# Altium project 200226 Precharge Controller R4 (GEN2).PrjPcb
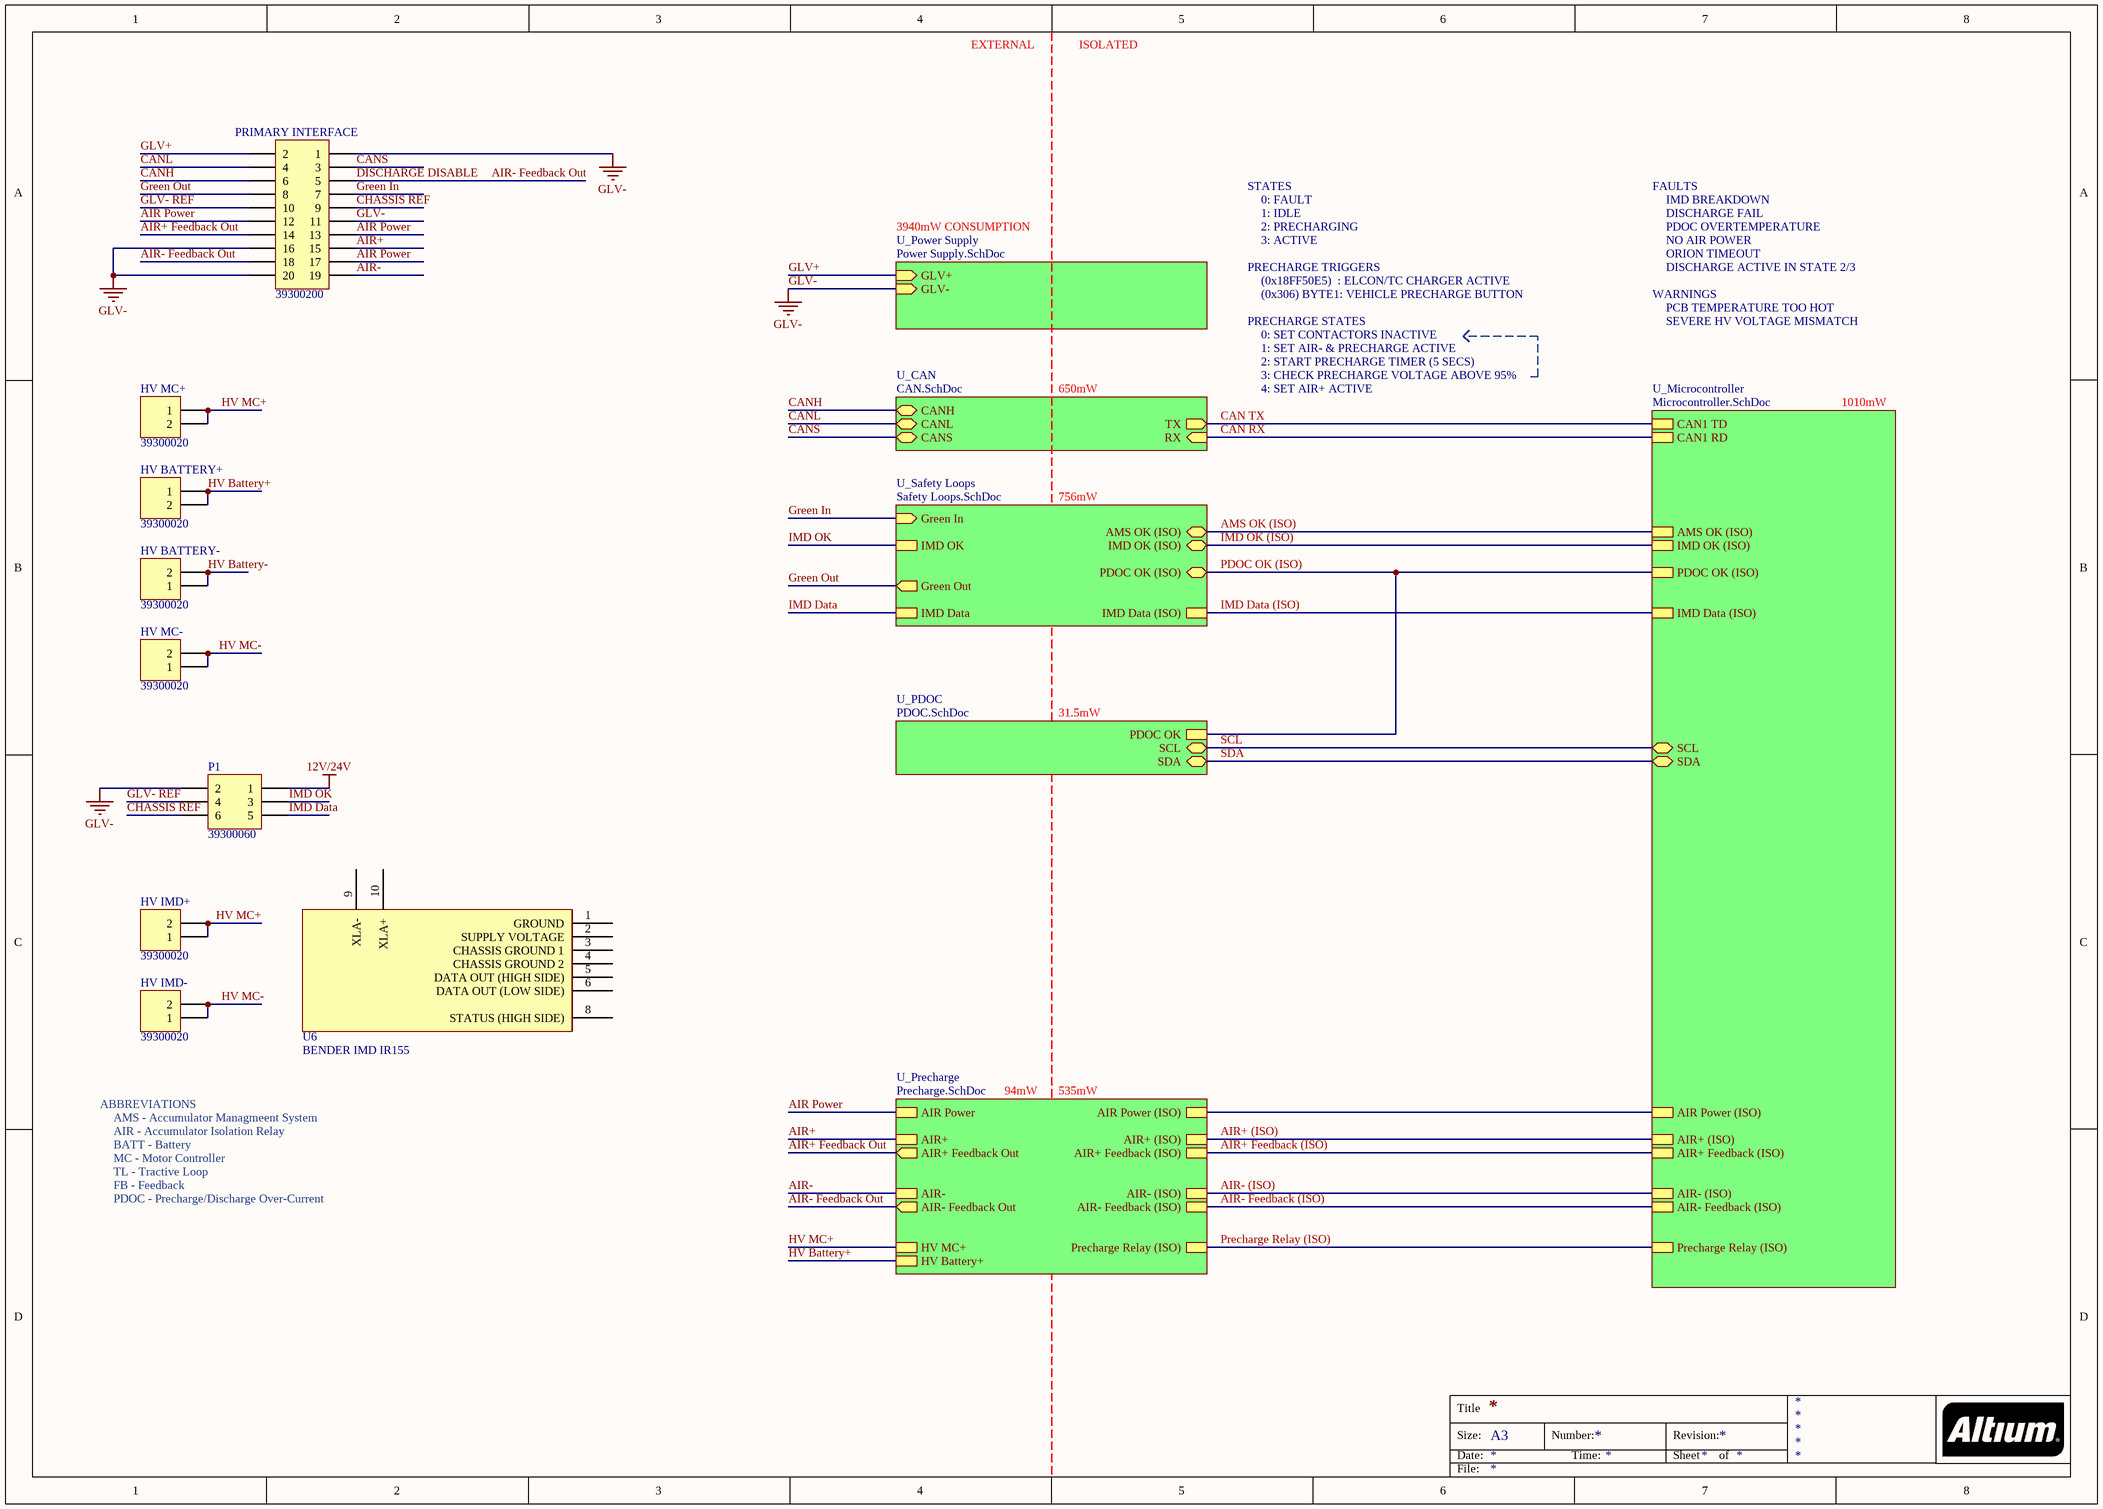
[diagram p0: Top Level.SchDoc]
4 sheets, 112 parts. Net scope: hierarchical (ports join the sheet entries above them; power ports are global).
Board file: 191228 PCB.PcbDoc
Sheets:
  Top Level.SchDoc
    U_CAN = CAN.SchDoc
    U_Precharge = Precharge.SchDoc
    U_Safety Loops = Safety Loops.SchDoc

## Sheet Top Level.SchDoc
size A3

### Parts
HV_BATTERY+  39300020  [39300020]
HV_BATTERY-  39300020  [39300020]
HV_IMD+  39300020  [39300020]
HV_IMD-  39300020  [39300020]
HV_MC+  39300020  [39300020]
HV_MC-  39300020  [39300020]
P1  39300060  [39300060]
PRIMARY_INTERFACE  39300200  [39300200]
U6  BENDER IMD IR155  [BENDER IMD IR155]

### Sub-sheets
U_CAN = CAN.SchDoc: CANH (bidir), CANL (bidir), CANS (bidir), RX (in), TX (out)
U_Microcontroller = Microcontroller.SchDoc (file not in this document): AIR- Feedback (ISO), AIR+ Feedback (ISO), AIR- (ISO), Precharge Relay (ISO), AIR+ (ISO), CAN1 TD, CAN1 RD, AIR Power (ISO), IMD OK (ISO), PDOC OK (ISO), AMS OK (ISO), IMD Data (ISO), SCL (bidir), SDA (bidir)
U_PDOC = PDOC.SchDoc (file not in this document): PDOC OK, SCL (bidir), SDA (bidir)
U_Power Supply = Power Supply.SchDoc (file not in this document): GLV+ (in), GLV- (in)
U_Precharge = Precharge.SchDoc: AIR Power, AIR- (ISO), AIR- Feedback Out (out), AIR- Feedback (ISO), AIR-, AIR+, AIR+ Feedback Out (out), AIR+ (ISO), AIR+ Feedback (ISO), Precharge Relay (ISO), HV MC+, HV Battery+, AIR Power (ISO)
U_Safety Loops = Safety Loops.SchDoc: IMD OK (ISO) (bidir), AMS OK (ISO) (bidir), PDOC OK (ISO) (bidir), Green In (in), IMD OK, Green Out (out), IMD Data, IMD Data (ISO)

### Nets
12V/24V: P1.1
AIR Power: PRIMARY_INTERFACE.12 PRIMARY_INTERFACE.13 PRIMARY_INTERFACE.17 ; sheet U_Precharge/AIR Power
GLV-: P1.2 PRIMARY_INTERFACE.1 PRIMARY_INTERFACE.11 PRIMARY_INTERFACE.16 PRIMARY_INTERFACE.20 ; sheet U_Power Supply/GLV-
AIR+: PRIMARY_INTERFACE.15 ; sheet U_Precharge/AIR+
AIR+ (ISO): sheet U_Precharge/AIR+ (ISO), sheet U_Microcontroller/AIR+ (ISO)
AIR+ Feedback (ISO): sheet U_Precharge/AIR+ Feedback (ISO), sheet U_Microcontroller/AIR+ Feedback (ISO)
AIR+ Feedback Out: PRIMARY_INTERFACE.14 ; sheet U_Precharge/AIR+ Feedback Out
AIR-: PRIMARY_INTERFACE.19 ; sheet U_Precharge/AIR-
AIR- (ISO): sheet U_Precharge/AIR- (ISO), sheet U_Microcontroller/AIR- (ISO)
AIR- Feedback (ISO): sheet U_Precharge/AIR- Feedback (ISO), sheet U_Microcontroller/AIR- Feedback (ISO)
AIR- Feedback Out: PRIMARY_INTERFACE.5 PRIMARY_INTERFACE.18 ; sheet U_Precharge/AIR- Feedback Out  [also labelled DISCHARGE DISABLE]
AMS OK (ISO): sheet U_Microcontroller/AMS OK (ISO), sheet U_Safety Loops/AMS OK (ISO)
CAN RX: sheet U_CAN/RX, sheet U_Microcontroller/CAN1 RD
CAN TX: sheet U_CAN/TX, sheet U_Microcontroller/CAN1 TD
CANH: PRIMARY_INTERFACE.6 ; sheet U_CAN/CANH
CANL: PRIMARY_INTERFACE.4 ; sheet U_CAN/CANL
CANS: PRIMARY_INTERFACE.3 ; sheet U_CAN/CANS
CHASSIS REF: P1.6 PRIMARY_INTERFACE.9
GLV+: PRIMARY_INTERFACE.2 ; sheet U_Power Supply/GLV+
GLV- REF: P1.4 PRIMARY_INTERFACE.10
Green In: PRIMARY_INTERFACE.7 ; sheet U_Safety Loops/Green In
Green Out: PRIMARY_INTERFACE.8 ; sheet U_Safety Loops/Green Out
HV Battery+: HV_BATTERY+.1 HV_BATTERY+.2 ; sheet U_Precharge/HV Battery+
HV Battery-: HV_BATTERY-.1 HV_BATTERY-.2
HV MC+: HV_IMD+.1 HV_IMD+.2 HV_MC+.1 HV_MC+.2 ; sheet U_Precharge/HV MC+
HV MC-: HV_IMD-.1 HV_IMD-.2 HV_MC-.1 HV_MC-.2
IMD Data: P1.5 ; sheet U_Safety Loops/IMD Data
IMD Data (ISO): sheet U_Microcontroller/IMD Data (ISO), sheet U_Safety Loops/IMD Data (ISO)
IMD OK: P1.3 ; sheet U_Safety Loops/IMD OK
IMD OK (ISO): sheet U_Microcontroller/IMD OK (ISO), sheet U_Safety Loops/IMD OK (ISO)
PDOC OK (ISO): sheet U_Microcontroller/PDOC OK (ISO), sheet U_Safety Loops/PDOC OK (ISO), sheet U_PDOC/PDOC OK
Precharge Relay (ISO): sheet U_Precharge/Precharge Relay (ISO), sheet U_Microcontroller/Precharge Relay (ISO)
SCL: sheet U_Microcontroller/SCL, sheet U_PDOC/SCL
SDA: sheet U_Microcontroller/SDA, sheet U_PDOC/SDA
NetAIR_POW_TP1_1: sheet U_Precharge/AIR Power (ISO), sheet U_Microcontroller/AIR Power (ISO)

Not connected (* = marked no-connect by the designer): U6 1(GROUND) 2(SUPPLY_VOLTAGE) 3(CHASSIS_GROUND_1) 4(CHASSIS_GROUND_2) 5(DATA_OUT_(HIGH_SIDE)) 6(DATA_OUT_(LOW_SIDE)) 8(STATUS_(HIGH_SIDE)) 9(XLA-) 10(XLA+)

### Notes on the sheet
- EXTERNAL
- ISOLATED
- 3940mW CONSUMPTION
- STATES
- 0: FAULT
- 1: IDLE
- 2: PRECHARGING
- 3: ACTIVE
- FAULTS
- IMD BREAKDOWN
- DISCHARGE FAIL
- PDOC OVERTEMPERATURE
- NO AIR POWER
- PRECHARGE TRIGGERS
- (0x18FF50E5)  : ELCON/TC CHARGER ACTIVE
- (0x306) BYTE1: VEHICLE PRECHARGE BUTTON
- WARNINGS
- PCB TEMPERATURE TOO HOT
- ORION TIMEOUT
- DISCHARGE ACTIVE IN STATE 2/3
- PRECHARGE STATES
- 1: SET AIR- & PRECHARGE ACTIVE
- 2: START PRECHARGE TIMER (5 SECS)
- 3: CHECK PRECHARGE VOLTAGE ABOVE 95%
- 0: SET CONTACTORS INACTIVE
- SEVERE HV VOLTAGE MISMATCH
- 650mW
- 4: SET AIR+ ACTIVE
- 1010mW
- 756mW
- 31.5mW
- ABBREVIATIONS
- AMS - Accumulator Managmeent System
- 94mW
- 535mW
- TL - Tractive Loop
- FB - Feedback
- BATT - Battery
- MC - Motor Controller
- AIR - Accumulator Isolation Relay
- PDOC - Precharge/Discharge Over-Current
- Title
- Size:
- Date:
- A3
- Number:
- Time:
- Revision:
- Sheet
- of
- File:

### Library data of the parts
HV_BATTERY+ HV_BATTERY- HV_IMD+ HV_IMD- HV_MC+ HV_MC- = 39300020: Positions: 2; Pitch: 4.2mm; Row Spacing: 5.5mm; Angle: 90; Flange: No; Contact: Tin; Part Number: 39300020; Digikey Part Number: WM21351-ND
P1 = 39300060: Positions: 6; Pitch: 4.2mm; Row Spacing: 5.5mm; Angle: 90; Flange: No; Contact: Tin; Part Number: 39300060; Digikey Part Number: WM21353-ND
PRIMARY_INTERFACE = 39300200: Positions: 20; Pitch: 4.2mm; Row Spacing: 5.5mm; Angle: 90; Flange: No; Contact: Tin; Part Number: 39300200; Digikey Part Number: WM21360-ND
U6 = BENDER IMD IR155: Insulation monitoring device (IMD) for unearthed DC drive systems (IT systems) in electric vehicles.; Part Number: BENDER IMD IR155; Manufacturer: Bender; Link: https://www.bender.de/en/products/insulation-monitoring/isometer_ir155-3203ir155-3204

## Sheet CAN.SchDoc
size A4
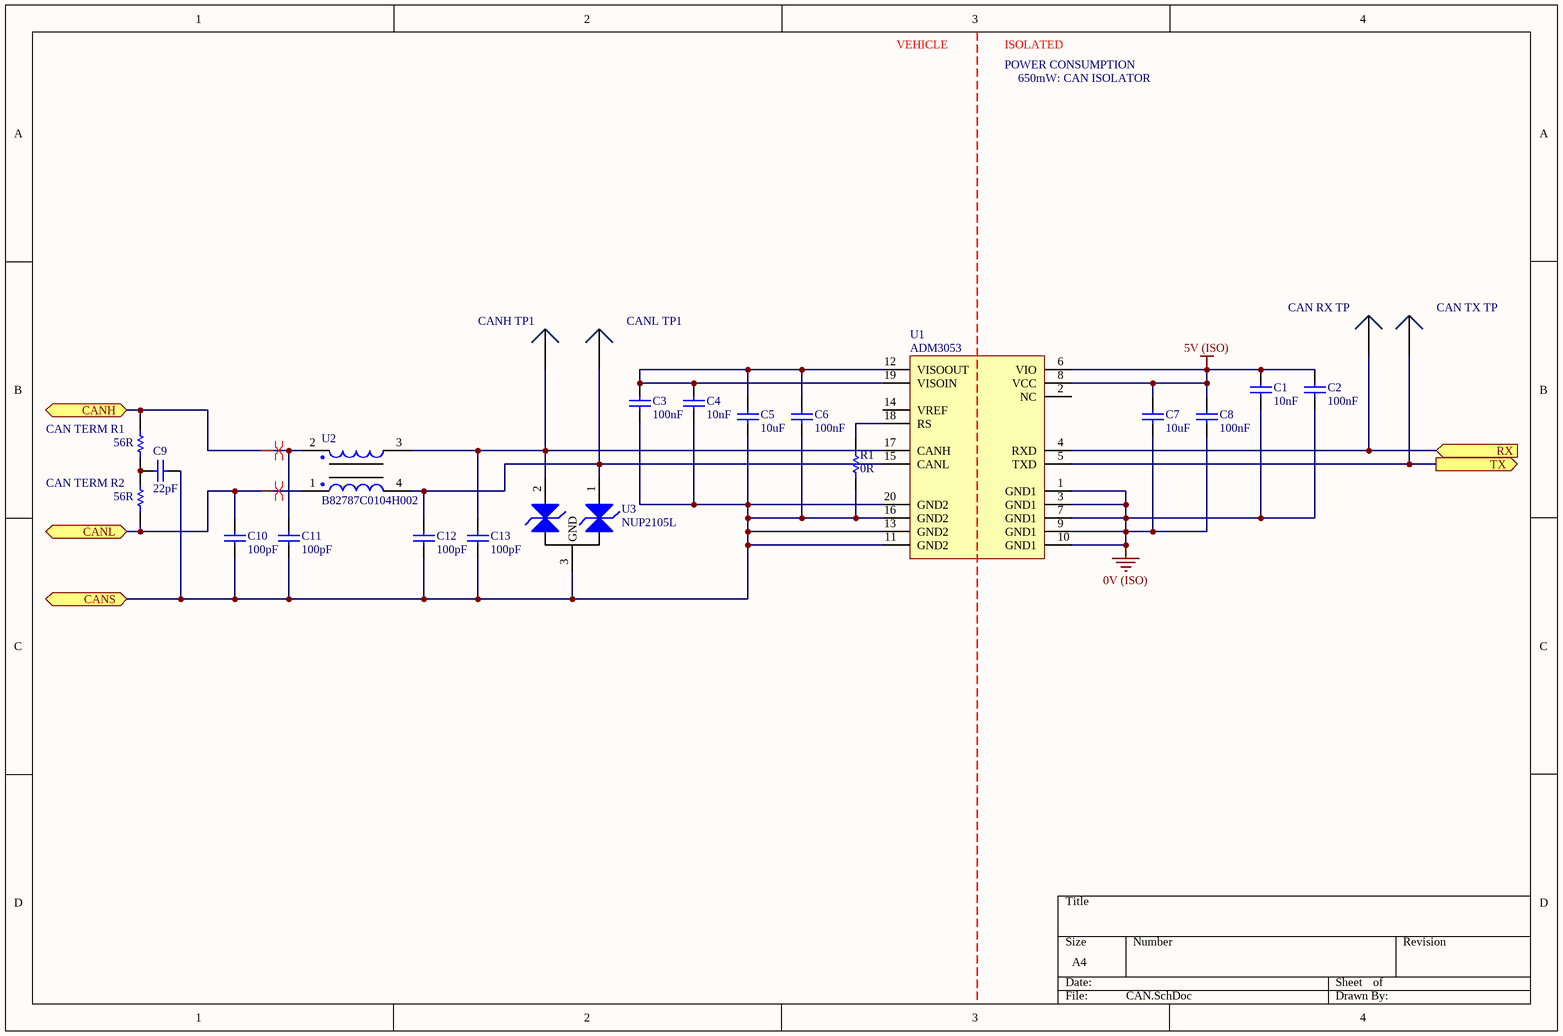
[diagram p1: CAN.SchDoc]

### Parts
C1  10nF  [1206]
C2  100nF  [0805]
C3  100nF  [0805]
C4  10nF  [1206]
C5  10uF  [0805]
C6  100nF  [0805]
C7  10uF  [0805]
C8  100nF  [0805]
C9  22pF  [0805]
C10  100pF  [0805]
C11  100pF  [0805]
C12  100pF  [0805]
C13  100pF  [0805]
CAN_RX_TP  0mm  [SMD Test Point]  (value not drawn)
CAN_TERM_R1  56R  [0805]
CAN_TERM_R2  56R  [0805]
CAN_TX_TP  0mm  [SMD Test Point]  (value not drawn)
CANH_TP1  0mm  [SMD Test Point]  (value not drawn)
CANL_TP1  0mm  [SMD Test Point]  (value not drawn)
R1  0R  [0805]
U1  ADM3053  [AD SOIC-W 20]
U2  B82787C0104H002  [TDK 4-PC Pad]
U3  NUP2105L  [ON SOT-23 BJT]

### Ports
CANH (bidir), CANL (bidir), CANS (bidir), RX (in), TX (out)

### Nets
0V (ISO): C1.1 C2.1 C7.1 C8.1 U1.1(GND1) U1.3(GND1) U1.7(GND1) U1.9(GND1) U1.10(GND1)
5V (ISO): C1.2 C2.2 C7.2 C8.2 U1.6(VIO) U1.8(VCC)
CAN RX: CAN_RX_TP.1 U1.4(RXD) ; port RX
CAN TX: CAN_TX_TP.1 U1.5(TXD) ; port TX
CANH: C11.2 CAN_TERM_R1.2 U2.2 ; port CANH
CANL: C10.2 CAN_TERM_R2.1 U2.1 ; port CANL
CANS: C3.1 C4.1 C5.1 C6.1 C9.1 C10.1 C11.1 C12.1 C13.1 R1.1 U1.11(GND2) U1.13(GND2) U1.16(GND2) U1.20(GND2) U3.3(GND) ; port CANS
NetC3_2: C3.2 C4.2 C5.2 C6.2 U1.12(VISOOUT) U1.19(VISOIN)
NetC9_2: C9.2 CAN_TERM_R1.1 CAN_TERM_R2.2
NetC12_2: C12.2 CANL_TP1.1 U1.15(CANL) U2.4 U3.1(CAN_H)
NetC13_2: C13.2 CANH_TP1.1 U1.17(CANH) U2.3 U3.2(CAN_L)
NetR1_2: R1.2 U1.18(RS)

Not connected (* = marked no-connect by the designer): U1 2(NC) 14(VREF)

### Layout directives
differential pair; differential pair class CANBUS OUT: CANH, CANL

### Notes on the sheet
- VEHICLE
- ISOLATED
- POWER CONSUMPTION
- 650mW: CAN ISOLATOR

### Library data of the parts
C1 C4 = GCM3195C2A103JA16D: Manufacturer: muRata; Tolerance: 5%; Material: Ceramic; Rated Voltage: 100V; Part Number: GCM3195C2A103JA16D; Value: 10nF; Digikey Part Number: 490-4978-2-ND
C2 C3 C6 C8 = GCM21BR71H104KA37L: Manufacturer: muRata; Tolerance: ±10%; Material: X7R; Rated Voltage: 50V; Part Number: GCM21BR71H104KA37L; Value: 100nF; Digikey Part Number: 490-6064-1-ND
C5 C7 = GRM21BR6YA106KE43L: Manufacturer: muRata; Tolerance: 10%; Material: X5R; Rated Voltage: 50V; Part Number: GRM21BR6YA106KE43L; Value: 10uF; Digikey Part Number: 490-10514-6-ND
C9 = GRM21A5C2E220JW01D: Manufacturer: muRata; Tolerance: ±5%; Material: C0G, NP0; Rated Voltage: 250V; Part Number: GRM21A5C2E220JW01D; Value: 22pF; Digikey Part Number: 490-5534-1-ND
C10-C13 = GCM2165C1H101JA16D: Manufacturer: muRata; Tolerance: ±5%; Material: C0G, NP0; Rated Voltage: 50V; Part Number: GCM2165C1H101JA16D; Value: 100pF; Digikey Part Number: 490-8031-1-ND
CAN_RX_TP CAN_TX_TP CANH_TP1 CANL_TP1 = SMD Test Point: Positions: 1; Row Spacing: 0; Flange: No; Contact: NA; Part Number: SMD Test Point; Pitch: 0mm; Angle: 0
CAN_TERM_R1 CAN_TERM_R2 = RC0805FR0756RL: Manufacturer: YAGEO; Tolerance: 0.01; Rated Voltage: 0.125W; Part Number: RC0805FR0756RL; Value: 56R; Material: FR-07; Digikey Part Number: 311-56.0CRCT-ND
R1 = RC0805FR070RL: Manufacturer: YAGEO; Tolerance: 0.01; Rated Voltage: 0.125W; Part Number: RC0805FR070RL; Value: 0R; Material: FR-07; Digikey Part Number: 311-0.0CRCT-ND
U1 = ADM3053: Isolated CAN Transceiver; Manufacturer: Analogue Devices; Part Number: ADM3053; Digikey Part Number: ADM3053BRWZ-ND; Digikey Link: https://www.digikey.com/product-detail/en/analog-devices-inc/ADM3053BRWZ/ADM3053BRWZ-ND/2709332
U2 = B82787C0104H002: 100µH @ 100kHz 2 Line Common Mode Choke Surface Mount 5.8 kOhms @ 10MHz 150mA DCR 2Ohm; Manufacturer: EPCOS (TDK); Part Number: B82787C0104H002; Inductance: 100µH @ 100kHz; Impedence: 5.8 kOhms @ 10MHz; Material: Wirewound; Rated Current: 150mA; Digikey Part Number: 495-4598-1-ND; Digikey Link: https://www.digikey.com/product-detail/en/epcos-tdk/B82787C0104H002/495-4598-2-ND/3680998
U3 = NUP2105L: Dual Line CAN Bus Protector; Manufacturer: ON Semiconductor; Part Number: NUP2105L; Digikey Part Number: NUP2105LT1GOSCT-ND; Digikey Link: https://www.digikey.com/product-detail/en/on-semiconductor/NUP2105LT1G/NUP2105LT1GOSCT-ND/1485001

## Sheet Precharge.SchDoc
size A3
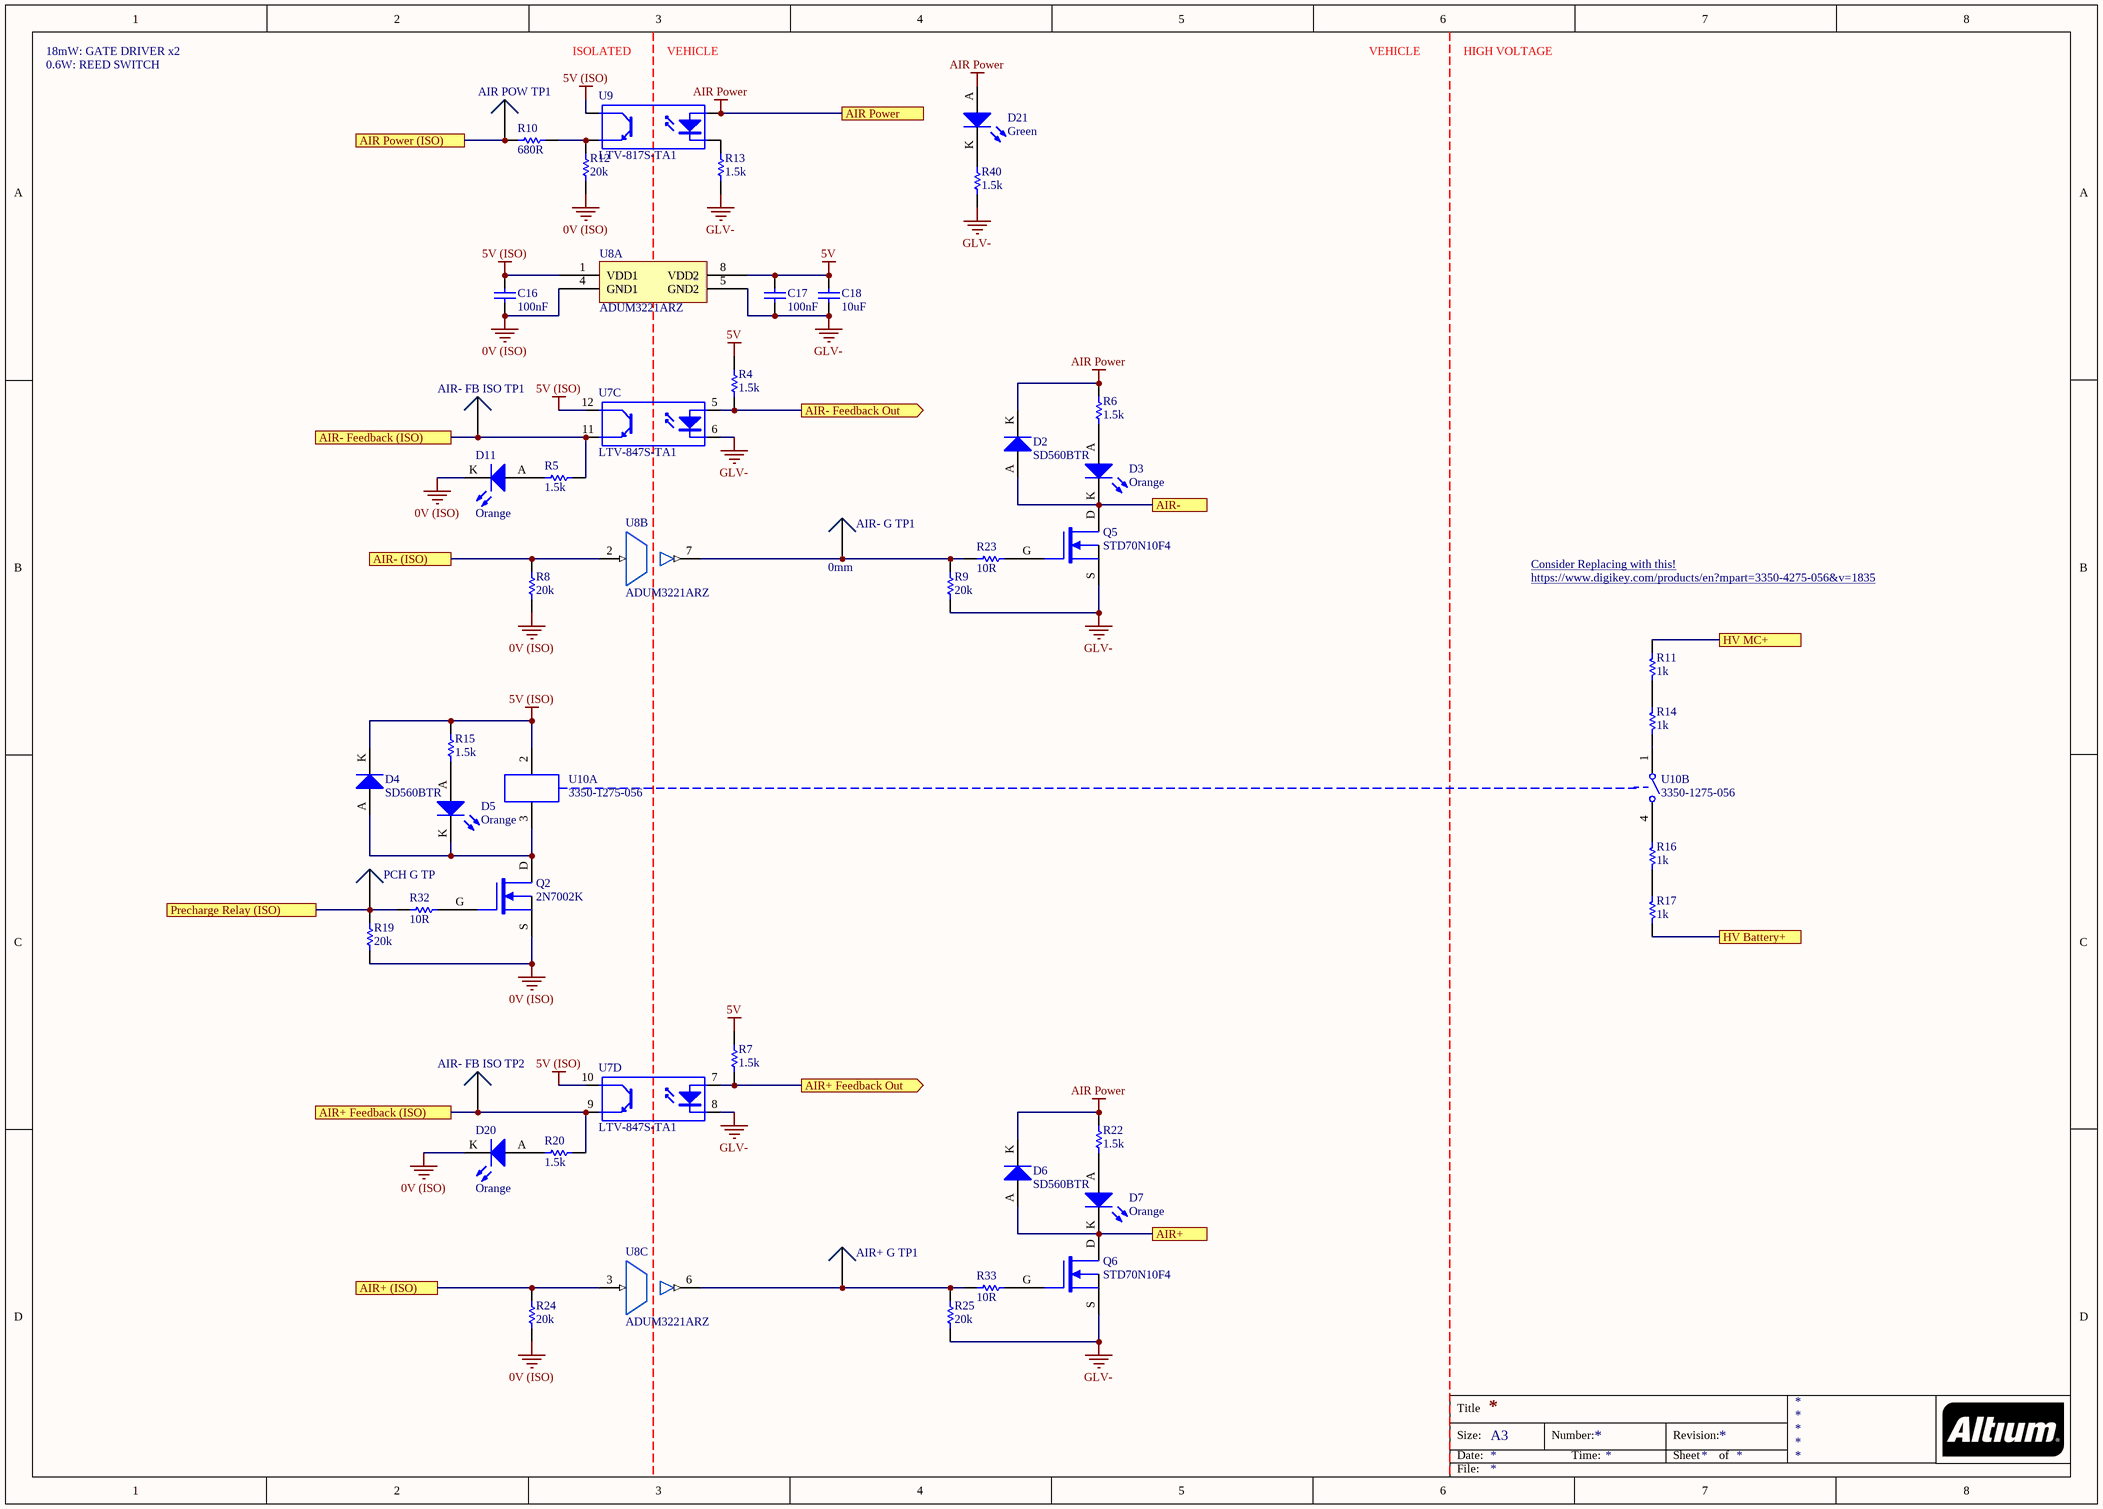
[diagram p2: Precharge.SchDoc]

### Parts
AIR+_G_TP1  0mm  [SMD Test Point]  (value not drawn)
AIR-_FB_ISO_TP1  0mm  [SMD Test Point]  (value not drawn)
AIR-_FB_ISO_TP2  0mm  [SMD Test Point]  (value not drawn)
AIR-_G_TP1  0mm  [SMD Test Point]
AIR_POW_TP1  0mm  [SMD Test Point]  (value not drawn)
C16  100nF  [0805]
C17  100nF  [0805]
C18  10uF  [0805]
D2  SD560BTR  [SMB Diode]
D3  Orange  [0805 LED]
D4  SD560BTR  [SMB Diode]
D5  Orange  [0805 LED]
D6  SD560BTR  [SMB Diode]
D7  Orange  [0805 LED]
D11  Orange  [0805 LED]
D20  Orange  [0805 LED]
D21  Green  [0805 LED]
PCH_G_TP  0mm  [SMD Test Point]  (value not drawn)
Q2  2N7002K  [SOT-343_N]
Q5  STD70N10F4  [SOT-343_N]
Q6  STD70N10F4  [SOT-343_N]
R4  1.5k  [0805]
R5  1.5k  [0805]
R6  1.5k  [0805]
R7  1.5k  [0805]
R8  20k  [0805]
R9  20k  [0805]
R10  680R  [0805]
R11  1k  [B TO-263]
R12  20k  [0805]
R13  1.5k  [0805]
R14  1k  [B TO-263]
R15  1.5k  [0805]
R16  1k  [B TO-263]
R17  1k  [B TO-263]
R19  20k  [0805]
R20  1.5k  [0805]
R22  1.5k  [0805]
R23  10R  [0805]
R24  20k  [0805]
R25  20k  [0805]
R32  10R  [0805]
R33  10R  [0805]
R40  1.5k  [0805]
U7  LTV-847S-TA1  [ON 16-SMD]  (parts C,D of 4)
U8  ADUM3221ARZ  [AD 8-SOIC]  (parts A,B,C of 3)
U9  LTV-817S-TA1  [ON 4-SMD]
U10  3350-1275-056  [CI SPST]  (parts A,B of 2)

### Ports
AIR Power, AIR Power (ISO), AIR+, AIR+ (ISO), AIR+ Feedback (ISO), AIR+ Feedback Out (out), AIR-, AIR- (ISO), AIR- Feedback (ISO), AIR- Feedback Out (out), HV Battery+, HV MC+, Precharge Relay (ISO)

### Nets
0V (ISO): C16.1 D11.K D20.K Q2.S R8.1 R12.1 R19.1 R24.1 U8.4(GND1)
5V: C17.2 C18.2 R4.2 R7.2 U8.8(VDD2)
5V (ISO): C16.2 D4.K R15.2 U7.10(C) U7.12(C) U8.1(VDD1) U9.4(C) U10.2
AIR Power: D2.K D6.K D21.A R6.2 R22.2 U9.1(A) ; port AIR Power
GLV-: C17.1 C18.1 Q5.S Q6.S R9.1 R13.2 R25.1 R40.2 U7.6(K) U7.8(K) U8.5(GND2)
AIR+: D6.A D7.K Q6.D ; port AIR+
AIR+ (ISO): R24.2 U8.3(VIA) ; port AIR+ (ISO)
AIR+ Feedback (ISO): AIR-_FB_ISO_TP2.1 R20.2 U7.9(E) ; port AIR+ Feedback (ISO)
AIR+ Feedback Out: R7.1 U7.7(A) ; port AIR+ Feedback Out
AIR-: D2.A D3.K Q5.D ; port AIR-
AIR- (ISO): R8.2 U8.2(VIA) ; port AIR- (ISO)
AIR- Feedback (ISO): AIR-_FB_ISO_TP1.1 R5.2 U7.11(E) ; port AIR- Feedback (ISO)
AIR- Feedback Out: R4.1 U7.5(A) ; port AIR- Feedback Out
HV Battery+: R17.1 ; port HV Battery+
HV MC+: R11.2 ; port HV MC+
Precharge Relay (ISO): PCH_G_TP.1 R19.2 R32.1 ; port Precharge Relay (ISO)
NetAIR+_G_TP1_1: AIR+_G_TP1.1 R25.2 R33.1 U8.6(VOA)
NetAIR-_G_TP1_1: AIR-_G_TP1.1 R9.2 R23.1 U8.7(VOA)
NetAIR_POW_TP1_1: AIR_POW_TP1.1 R10.1 ; port AIR Power (ISO)
NetD3_A: D3.A R6.1
NetD4_A: D4.A D5.K Q2.D U10.3
NetD5_A: D5.A R15.1
NetD7_A: D7.A R22.1
NetD11_A: D11.A R5.1
NetD20_A: D20.A R20.1
NetD21_K: D21.K R40.1
NetQ2_G: Q2.G R32.2
NetQ5_G: Q5.G R23.2
NetQ6_G: Q6.G R33.2
NetR10_2: R10.2 R12.2 U9.3(E)
NetR11_1: R11.1 R14.2
NetR13_1: R13.1 U9.2(K)
NetR14_1: R14.1 U10.1
NetR16_1: R16.1 R17.2
NetR16_2: R16.2 U10.4

### Notes on the sheet
- 18mW: GATE DRIVER x2
- 0.6W: REED SWITCH
- ISOLATED
- VEHICLE
- HIGH VOLTAGE
- https://www.digikey.com/products/en?mpart=3350-4275-056&v=1835
- Consider Replacing with this! <https://www.digikey.com/products/en?mpart=3350-4275-056&v=1835>
- Title
- Size:
- Date:
- A3
- Number:
- Time:
- Revision:
- Sheet
- of
- File:

### Library data of the parts
AIR+_G_TP1 AIR-_FB_ISO_TP1 AIR-_FB_ISO_TP2 AIR-_G_TP1 AIR_POW_TP1 PCH_G_TP = SMD Test Point: as CAN_RX_TP on sheet CAN; Part Number: SMD Test Point; Pitch: 0mm; Angle: 0
C16 C17 = GCM21BR71H104KA37L: as C2 on sheet CAN; Part Number: GCM21BR71H104KA37L; Value: 100nF; Digikey Part Number: 490-6064-1-ND
C18 = GRM21BR6YA106KE43L: as C5 on sheet CAN; Part Number: GRM21BR6YA106KE43L; Value: 10uF; Digikey Part Number: 490-10514-6-ND
D2 D4 D6 = SD560BTR: 1.2V_F 600V 5A SMB; Manufacturer: SMC Diode Solutions; Part Number: SD560BTR; Digikey Part Number: 1655-1530-2-ND; Digikey Link: https://www.digikey.com/product-detail/en/smc-diode-solutions/SD560BTR/1655-1530-2-ND/6022620
D3 D5 D7 D11 D20 = SML-211DTT86: Orange LED Indication - Discrete 1.75V 0805 (2012 Metric); Manufacturer: ROHM Semiconductor; Part Number: SML-211DTT86; Colour: Orange; Digikey Part Number: 511-1291-1-ND; Digikey Link: https://www.digikey.com/product-detail/en/rohm-semiconductor/SML-211DTT86/511-1291-1-ND/637104
D21 = SML-210FTT86: Green LED Indication - Discrete 1.75V 0805 (2012 Metric); Manufacturer: ROHM Semiconductor; Part Number: SML-210FTT86; Colour: Green; Digikey Part Number: 511-1285-1-ND; Digikey Link: https://www.digikey.com/product-detail/en/rohm-semiconductor/SML-210FTT86/511-1285-1-ND/637098
Q2 = 2N7002K: 60V 380mA, NFET MOSTFET (Small Signal); Manufacturer: ON Semiconductor; Published: 24-Mar-1999; LatestRevisionDate: 29-May-2009; LatestRevisionNote: IPC-7351 Footprint Added.; PackageVersion: Sep-2000; PackageReference: SOT-343; Publisher: Altium Limited; PackageDescription: 4-Pin SOT-343 Package 1.3 mm Pitch, 2.1 mm Lead Span; Part Number: 2N7002K; Digikey Part Number: 2N7002KCT-ND; Digikey Link: https://www.digikey.com/product-detail/en/on-semiconductor/2N7002K/2N7002KCT-ND/2060375; Qty: 30
Q5 Q6 = STD70N10F4: N-Channel 100V 60A (Tc) 125W (Tc) Surface Mount DPAK; Manufacturer: STMicroelectronics; Published: 24-Mar-1999; LatestRevisionDate: 29-May-2009; LatestRevisionNote: IPC-7351 Footprint Added.; PackageVersion: Sep-2000; PackageReference: SOT-343; Publisher: Altium Limited; PackageDescription: 4-Pin SOT-343 Package 1.3 mm Pitch, 2.1 mm Lead Span; Part Number: STD70N10F4; Digikey Part Number: 497-8806-2-ND; Digikey Link: https://www.digikey.com/product-detail/en/stmicroelectronics/STD70N10F4/497-8806-2-ND/2035599
R4-R7 R13 R15 R20 R22 R40 = RC0805FR071K5L: Manufacturer: YAGEO; Tolerance: 0.01; Rated Voltage: 0.125W; Part Number: RC0805FR071K5L; Value: 1.5k; Material: FR-07; Digikey Part Number: 311-1.50KCRCT-ND
R8 R9 R12 R19 R24 R25 = RC0805FR0720KL: Manufacturer: YAGEO; Tolerance: 0.01; Rated Voltage: 0.125W; Part Number: RC0805FR0720KL; Value: 20k; Material: FR-07; Digikey Part Number: 311-20.0KCRCT-ND
R10 = RC0805FR07680RL: Manufacturer: YAGEO; Tolerance: 0.01; Rated Voltage: 0.125W; Part Number: RC0805FR07680RL; Value: 680R; Material: FR-07; Digikey Part Number: 311-680CRCT-ND
R11 R14 R16 R17 = PWR263S-35-1001J: Manufacturer: Bournes Inc; Tolerance: 0.05; Rated Voltage: 35W; Part Number: PWR263S-35-1001J; Value: 1k; Digikey Part Number: PWR263S-35-1001J-ND
R23 R32 R33 = RC0805FR0710RL: Manufacturer: YAGEO; Tolerance: 0.01; Rated Voltage: 0.125W; Part Number: RC0805FR0710RL; Value: 10R; Material: FR-07; Digikey Part Number: 311-10.0CRCT-ND
U7 = LTV-847S-TA1: Optoisolator Transistor Output 5000Vrms 4 Channel 16-SMD; Manufacturer: Lite-On Inc; Part Number: LTV-847S-TA1; Digikey Part Number: 160-1371-5-ND; Digikey Link: https://www.digikey.com.au/product-detail/en/lite-on-inc/LTV-847S/160-1371-5-ND/385841
U8 = ADUM3221ARZ: 4A Gate Driver Magnetic Coupling 2500Vrms 2 Channel 8-SOIC; Manufacturer: Analog Devices; Part Number: ADUM3221ARZ; Digikey Part Number: ADUM3221ARZ-ND; Digikey Link: https://www.digikey.com/product-detail/en/analog-devices-inc/ADUM3221ARZ/ADUM3221ARZ-ND/2616333
U9 = LTV-817S-TA1: 35V 50ma Optocoupler (VF=1.2V); Manufacturer: Lite-On Inc; Part Number: LTV-817S-TA1; Digikey Part Number: 160-1893-2-ND; Digikey Link: https://www.digikey.com/product-detail/en/lite-on-inc/LTV-817S-TA1/160-1893-2-ND/388451
U10 = 3350-1275-056: RELAY REED HV SPST 200W 3A 5V (NO); Manufacturer: Comus International; Part Number: 3350-1275-056; Digikey Part Number: 1835-1036-ND; Digikey Link: https://www.digikey.com.au/product-detail/en/comus-international/3350-1275-056/1835-1036-ND/7515918

## Sheet Safety Loops.SchDoc
size A3
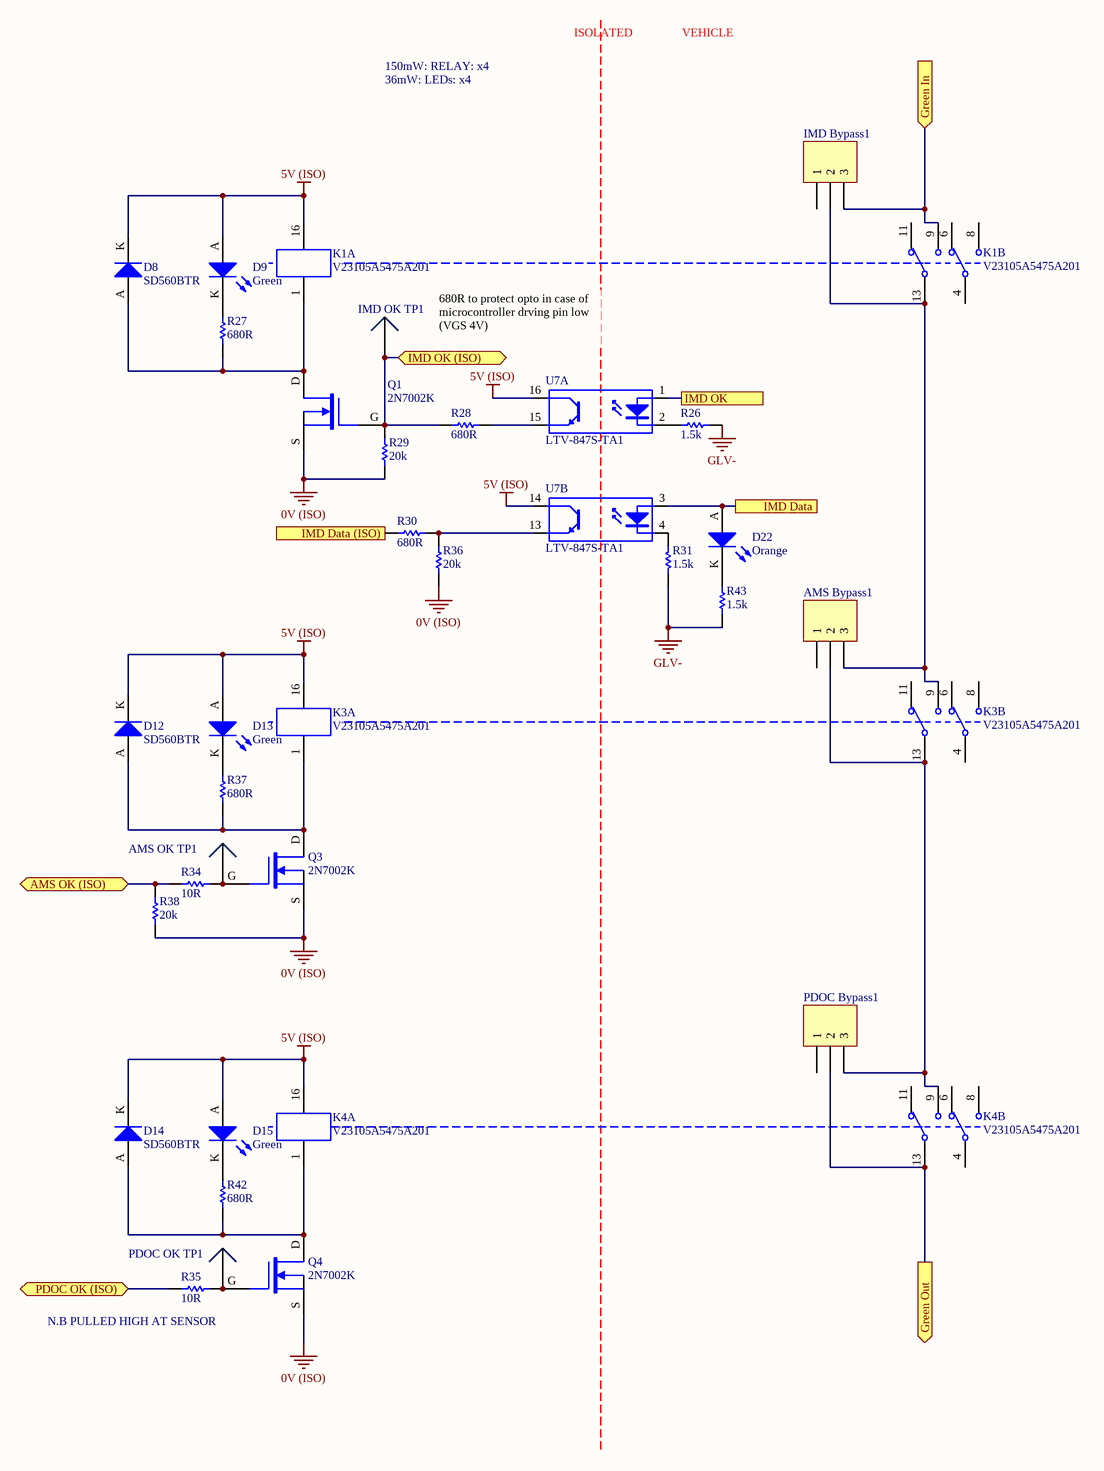
[diagram p3: Safety Loops.SchDoc]

### Parts
AMS_Bypass1  2.54mm  [TH 2.54mm Header 1x3]  (value not drawn)
AMS_OK_TP1  0mm  [SMD Test Point]  (value not drawn)
D8  SD560BTR  [SMB Diode]
D9  Green  [0805 LED]
D12  SD560BTR  [SMB Diode]
D13  Green  [0805 LED]
D14  SD560BTR  [SMB Diode]
D15  Green  [0805 LED]
D22  Orange  [0805 LED]
IMD_Bypass1  2.54mm  [TH 2.54mm Header 1x3]  (value not drawn)
IMD_OK_TP1  0mm  [SMD Test Point]  (value not drawn)
K1  V23105A5475A201  [TI 2-DIL]  (parts A,B of 2)
K3  V23105A5475A201  [TI 2-DIL]  (parts A,B of 2)
K4  V23105A5475A201  [TI 2-DIL]  (parts A,B of 2)
PDOC_Bypass1  2.54mm  [TH 2.54mm Header 1x3]  (value not drawn)
PDOC_OK_TP1  0mm  [SMD Test Point]  (value not drawn)
Q1  2N7002K  [SOT-343_N]
Q3  2N7002K  [SOT-343_N]
Q4  2N7002K  [SOT-343_N]
R26  1.5k  [0805]
R27  680R  [0805]
R28  680R  [0805]
R29  20k  [0805]
R30  680R  [0805]
R31  1.5k  [0805]
R34  10R  [0805]
R35  10R  [0805]
R36  20k  [0805]
R37  680R  [0805]
R38  20k  [0805]
R42  680R  [0805]
R43  1.5k  [0805]
U7  LTV-847S-TA1  [ON 16-SMD]  (parts A,B of 4)

### Ports
AMS OK (ISO) (bidir), Green In (in), Green Out (out), IMD Data, IMD Data (ISO), IMD OK, IMD OK (ISO) (bidir), PDOC OK (ISO) (bidir)

### Nets
0V (ISO): Q1.S Q3.S Q4.S R29.1 R36.1 R38.1
5V (ISO): D8.K D9.A D12.K D13.A D14.K D15.A K1.16 K3.16 K4.16 U7.14(C) U7.16(C)
GLV-: R26.1 R31.2 R43.2
AMS OK (ISO): R34.1 R38.2 ; port AMS OK (ISO)
Green In: IMD_Bypass1.3 K1.9 ; port Green In
Green Out: K4.13 PDOC_Bypass1.2 ; port Green Out
IMD Data: D22.A U7.3(A) ; port IMD Data
IMD Data (ISO): R30.1 ; port IMD Data (ISO)
IMD OK: U7.1(A) ; port IMD OK
IMD OK (ISO): IMD_OK_TP1.1 Q1.G R28.1 R29.2 ; port IMD OK (ISO)
PDOC OK (ISO): R35.1 ; port PDOC OK (ISO)
NetAMS_Bypass1_2: AMS_Bypass1.2 K3.13 K4.9 PDOC_Bypass1.3
NetAMS_Bypass1_3: AMS_Bypass1.3 IMD_Bypass1.2 K1.13 K3.9
NetAMS_OK_TP1_1: AMS_OK_TP1.1 Q3.G R34.2
NetD8_A: D8.A K1.1 Q1.D R27.1
NetD9_K: D9.K R27.2
NetD12_A: D12.A K3.1 Q3.D R37.1
NetD13_K: D13.K R37.2
NetD14_A: D14.A K4.1 Q4.D R42.1
NetD15_K: D15.K R42.2
NetD22_K: D22.K R43.1
NetPDOC_OK_TP1_1: PDOC_OK_TP1.1 Q4.G R35.2
NetR26_2: R26.2 U7.2(K)
NetR28_2: R28.2 U7.15(E)
NetR30_2: R30.2 R36.2 U7.13(E)
NetR31_1: R31.1 U7.4(K)

Not connected (* = marked no-connect by the designer): AMS_Bypass1 1; IMD_Bypass1 1; K1 4 6 8 11; K3 4 6 8 11; K4 4 6 8 11; PDOC_Bypass1 1

### Notes on the sheet
- 150mW: RELAY: x4
- 36mW: LEDs: x4
- ISOLATED
- VEHICLE
- 680R to protect opto in case of microcontroller drving pin low (VGS 4V)
- (near R35) N.B PULLED HIGH AT SENSOR
- Title
- Size:
- Date:
- A3
- Number:
- Time:
- Revision:
- Sheet
- of
- File:

### Library data of the parts
AMS_Bypass1 IMD_Bypass1 PDOC_Bypass1 = TH 2.54mm Header 1x3: Positions: 3; Angle: 0; Flange: No; Contact: NA; Part Number: TH 2.54mm Header 1x3; Pitch: 2.54mm; Row Spacing: 2.54mm
AMS_OK_TP1 IMD_OK_TP1 PDOC_OK_TP1 = SMD Test Point: as CAN_RX_TP on sheet CAN; Part Number: SMD Test Point; Pitch: 0mm; Angle: 0
D8 D12 D14 = SD560BTR: as D2 on sheet Precharge; Part Number: SD560BTR; Digikey Part Number: 1655-1530-2-ND; Digikey Link: https://www.digikey.com/product-detail/en/smc-diode-solutions/SD560BTR/1655-1530-2-ND/6022620
D9 D13 D15 = SML-210FTT86: as D21 on sheet Precharge; Part Number: SML-210FTT86; Colour: Green; Digikey Part Number: 511-1285-1-ND; Digikey Link: https://www.digikey.com/product-detail/en/rohm-semiconductor/SML-210FTT86/511-1285-1-ND/637098
D22 = SML-211DTT86: as D3 on sheet Precharge; Part Number: SML-211DTT86; Colour: Orange; Digikey Part Number: 511-1291-1-ND; Digikey Link: https://www.digikey.com/product-detail/en/rohm-semiconductor/SML-211DTT86/511-1291-1-ND/637104
K1 K3 K4 = V23105A5475A201: 5V DPDT Relay 3A 220VDC; Manufacturer: Axicom; Part Number: V23105A5475A201; Digikey Part Number: PB383-ND; Digikey Link: https://www.digikey.com/products/en?mpart=V23105A5001A201&v=41
Q1 Q3 Q4 = 2N7002K: as Q2 on sheet Precharge; Published: 24-Mar-1999; LatestRevisionDate: 29-May-2009; LatestRevisionNote: IPC-7351 Footprint Added.; PackageVersion: Sep-2000; PackageReference: SOT-343; Publisher: Altium Limited; PackageDescription: 4-Pin SOT-343 Package 1.3 mm Pitch, 2.1 mm Lead Span; Part Number: 2N7002K; Digikey Part Number: 2N7002KCT-ND; Digikey Link: https://www.digikey.com/product-detail/en/on-semiconductor/2N7002K/2N7002KCT-ND/2060375; Qty: 30
R26 R31 R43 = RC0805FR071K5L: as R4 on sheet Precharge; Part Number: RC0805FR071K5L; Value: 1.5k; Material: FR-07; Digikey Part Number: 311-1.50KCRCT-ND
R27 R28 R30 R37 R42 = RC0805FR07680RL: as R10 on sheet Precharge; Part Number: RC0805FR07680RL; Value: 680R; Material: FR-07; Digikey Part Number: 311-680CRCT-ND
R29 R36 R38 = RC0805FR0720KL: as R8 on sheet Precharge; Part Number: RC0805FR0720KL; Value: 20k; Material: FR-07; Digikey Part Number: 311-20.0KCRCT-ND
R34 R35 = RC0805FR0710RL: as R23 on sheet Precharge; Part Number: RC0805FR0710RL; Value: 10R; Material: FR-07; Digikey Part Number: 311-10.0CRCT-ND
U7 = LTV-847S-TA1: as U7 on sheet Precharge; Part Number: LTV-847S-TA1; Digikey Part Number: 160-1371-5-ND; Digikey Link: https://www.digikey.com.au/product-detail/en/lite-on-inc/LTV-847S/160-1371-5-ND/385841

## Nets that join several sheets
0V (ISO): CAN (9 pins), Precharge (9 pins), Safety Loops (6 pins)
5V (ISO): CAN (6 pins), Precharge (8 pins), Safety Loops (11 pins)
AIR Power: Top Level (PRIMARY_INTERFACE.12 PRIMARY_INTERFACE.13 PRIMARY_INTERFACE.17), Precharge (6 pins)
GLV-: Top Level (5 pins), Precharge (11 pins), Safety Loops (R26.1 R31.2 R43.2)
AIR+: Top Level (PRIMARY_INTERFACE.15), Precharge (D6.A D7.K Q6.D)
AIR+ Feedback Out: Top Level (PRIMARY_INTERFACE.14), Precharge (R7.1 U7.7)
AIR-: Top Level (PRIMARY_INTERFACE.19), Precharge (D2.A D3.K Q5.D)
AIR- Feedback Out: Top Level (PRIMARY_INTERFACE.5 PRIMARY_INTERFACE.18), Precharge (R4.1 U7.5)
CANH: Top Level (PRIMARY_INTERFACE.6), CAN (C11.2 CAN_TERM_R1.2 U2.2)
CANL: Top Level (PRIMARY_INTERFACE.4), CAN (C10.2 CAN_TERM_R2.1 U2.1)
CANS: Top Level (PRIMARY_INTERFACE.3), CAN (15 pins)
Green In: Top Level (PRIMARY_INTERFACE.7), Safety Loops (IMD_Bypass1.3 K1.9)
Green Out: Top Level (PRIMARY_INTERFACE.8), Safety Loops (K4.13 PDOC_Bypass1.2)
HV Battery+: Top Level (HV_BATTERY+.1 HV_BATTERY+.2), Precharge (R17.1)
HV MC+: Top Level (HV_IMD+.1 HV_IMD+.2 HV_MC+.1 HV_MC+.2), Precharge (R11.2)
IMD Data: Top Level (P1.5), Safety Loops (D22.A U7.3)
IMD OK: Top Level (P1.3), Safety Loops (U7.1)